# EAGLE schematic Hauptplatine_v_1_0 (EAGLE 7.3.0)
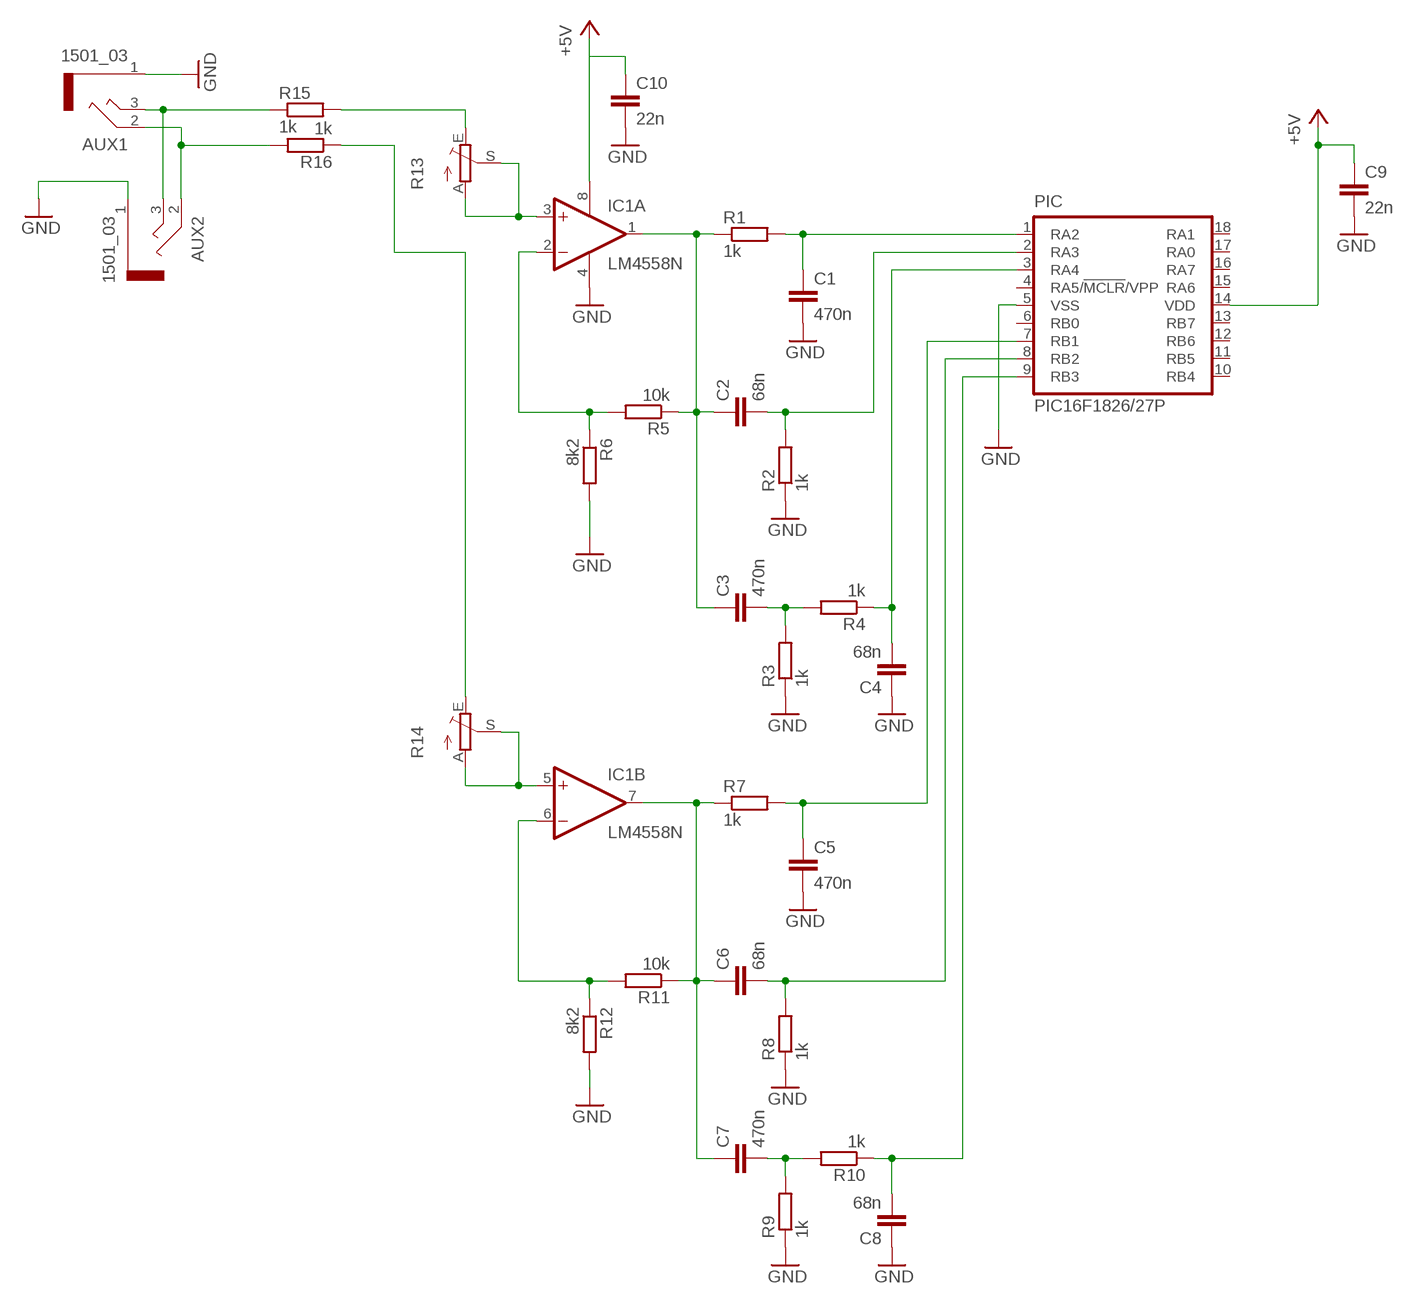
[diagram p0: schematic, sheet 1]

## Parts
AUX1  1501_03  [1501_03]
AUX2  1501_03  [1501_03]
C1  470n  C-EU_C1206K  [C1206]
C2  68n  C-EU_C1206K  [C1206]
C3  470n  C-EU_C1206K  [C1206]
C4  68n  C-EU_C1206K  [C1206]
C5  470n  C-EU_C1206K  [C1206]
C6  68n  C-EU_C1206K  [C1206]
C7  470n  C-EU_C1206K  [C1206]
C8  68n  C-EU_C1206K  [C1206]
C9  22n  C-EU_C1206K  [C1206]
C10  22n  C-EU_C1206K  [C1206]
IC1  LM4558N  [DIL08]
PIC  PIC16F1826/27P  [DIL18]
R1  1k  R-EU_R1206  [R_SMD1206]
R2  1k  R-EU_R1206  [R_SMD1206]
R3  1k  R-EU_R1206  [R_SMD1206]
R4  1k  R-EU_R1206  [R_SMD1206]
R5  10k  R-EU_R1206  [R_SMD1206]
R6  8k2  R-EU_R1206  [R_SMD1206]
R7  1k  R-EU_R1206  [R_SMD1206]
R8  1k  R-EU_R1206  [R_SMD1206]
R9  1k  R-EU_R1206  [R_SMD1206]
R10  1k  R-EU_R1206  [R_SMD1206]
R11  10k  R-EU_R1206  [R_SMD1206]
R12  8k2  R-EU_R1206  [R_SMD1206]
R13  POTIS_PTSPIN  [PT-SPIN]
R14  POTIS_PTSPIN  [PT-SPIN]
R15  1k  R-EU_R1206  [R_SMD1206]
R16  1k  R-EU_R1206  [R_SMD1206]

## Nets
+5V: C9.1 C10.1 IC1.8(P:V+) PIC.14(VDD)
AUX_IN_2: IC1.5(B:+IN) R14.A R14.S
GND: AUX1.1 AUX2.1 C1.2 C4.1 C5.2 C8.1 C9.2 C10.2 IC1.4(P:V-) PIC.5(VSS) R2.1 R3.1 R6.2 R8.1 R9.1 R12.2
N$1: C3.2 R3.2 R4.2
N$4: IC1.2(A:-IN) R5.2 R6.1
N$6: C4.2 PIC.3(RA4) R4.1
N$7: R13.E R15.2
N$8: C7.2 R9.2 R10.2
N$9: C8.2 PIC.9(RB3) R10.1
N$10: IC1.6(B:-IN) R11.2 R12.1
N$14: R14.E R16.1
N$15: IC1.3(A:+IN) R13.A R13.S
N$16: AUX1.2 AUX2.2 R16.2
N$17: AUX1.3 AUX2.3 R15.1
WHATEVER: C2.1 C3.1 IC1.1(A:OUT) R1.1 R5.1
WHATEVER1: C1.1 PIC.1(RA2) R1.2
WHATEVER2: C2.2 PIC.2(RA3) R2.2
WHATEVER3: C5.1 PIC.7(RB1) R7.2
WHATEVER4: C6.1 C7.1 IC1.7(B:OUT) R7.1 R11.1
WHATEVER5: C6.2 PIC.8(RB2) R8.2
Unconnected: PIC.4(RA5/!MCLR!/VPP) PIC.6(RB0) PIC.10(RB4) PIC.11(RB5) PIC.12(RB6) PIC.13(RB7) PIC.15(RA6) PIC.16(RA7) PIC.17(RA0) PIC.18(RA1)

## Library data of the parts
AUX1 AUX2 = stehlik-spezial:1501_03: Klinkensteckverbinder nach JISC 6560, 2,5 mm Jack connectors according to JISC 6560, 2.5 mm Source: http://www.lumberg.com/Produkte/PDFs/1501_03.pdf; OC_FARNELL: 1200127; OC_NEWARK: unknown
C1-C10 = htl3r-discrete:C-EU_: CAPACITOR, European symbol
IC1 = linear:*4558: OP AMP
PIC = microchip:PIC16*F1826/27: 18/20/28-Pin Flash Microcontrollers with nanoWatt XLP Technology Source: www.microchip.com PIC16F1827.pdf
R1-R12 R15 R16 = htl3r-discrete:R-EU_: RESISTOR, European symbol
R13 R14 = htl3r-discrete:POTIS_: POTENTIOMETER